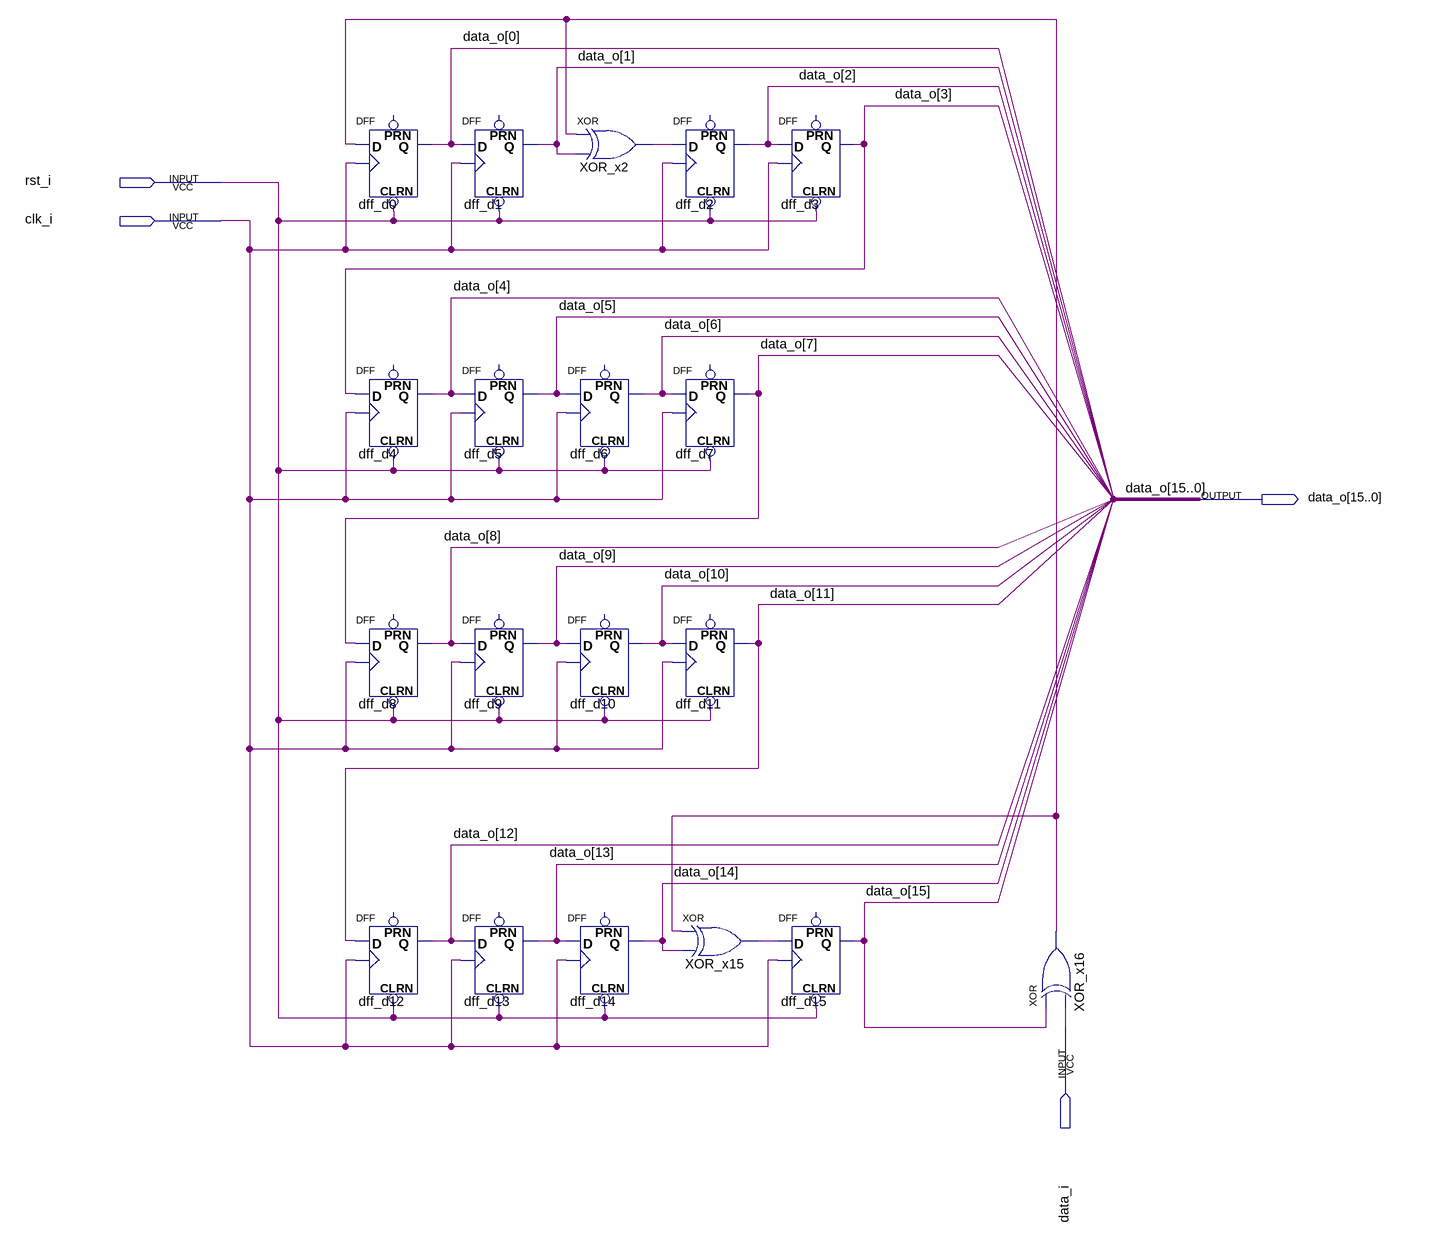
[diagram p0: schematic sheet]
// Quartus schematic crc_16_ansi.bdf as structural Verilog: 19 symbols, 4 pins
module crc_16_ansi (
  input  rst_i,
  input  clk_i,
  input  data_i,
  output [15:0] data_o
);

  wire XOR_x2_out, XOR_x15_out, XOR_x16_out;

  DFF dff_d0 (.CLRN(rst_i), .CLK(clk_i), .D(XOR_x16_out), .Q(data_o[0]));  // open: PRN
  DFF dff_d4 (.CLRN(rst_i), .CLK(clk_i), .D(data_o[3]), .Q(data_o[4]));  // open: PRN
  DFF dff_d8 (.CLRN(rst_i), .CLK(clk_i), .D(data_o[7]), .Q(data_o[8]));  // open: PRN
  DFF dff_d12 (.CLRN(rst_i), .CLK(clk_i), .D(data_o[11]), .Q(data_o[12]));  // open: PRN
  DFF dff_d1 (.CLRN(rst_i), .CLK(clk_i), .D(data_o[0]), .Q(data_o[1]));  // open: PRN
  DFF dff_d5 (.CLRN(rst_i), .CLK(clk_i), .D(data_o[4]), .Q(data_o[5]));  // open: PRN
  DFF dff_d9 (.CLRN(rst_i), .CLK(clk_i), .D(data_o[8]), .Q(data_o[9]));  // open: PRN
  DFF dff_d13 (.CLRN(rst_i), .CLK(clk_i), .D(data_o[12]), .Q(data_o[13]));  // open: PRN
  xor XOR_x2 (XOR_x2_out, XOR_x16_out, data_o[1]);
  DFF dff_d6 (.CLRN(rst_i), .CLK(clk_i), .D(data_o[5]), .Q(data_o[6]));  // open: PRN
  DFF dff_d10 (.CLRN(rst_i), .CLK(clk_i), .D(data_o[9]), .Q(data_o[10]));  // open: PRN
  DFF dff_d14 (.CLRN(rst_i), .CLK(clk_i), .D(data_o[13]), .Q(data_o[14]));  // open: PRN
  DFF dff_d2 (.CLRN(rst_i), .CLK(clk_i), .D(XOR_x2_out), .Q(data_o[2]));  // open: PRN
  DFF dff_d7 (.CLRN(rst_i), .CLK(clk_i), .D(data_o[6]), .Q(data_o[7]));  // open: PRN
  DFF dff_d11 (.CLRN(rst_i), .CLK(clk_i), .D(data_o[10]), .Q(data_o[11]));  // open: PRN
  xor XOR_x15 (XOR_x15_out, XOR_x16_out, data_o[14]);
  DFF dff_d3 (.CLRN(rst_i), .CLK(clk_i), .D(data_o[2]), .Q(data_o[3]));  // open: PRN
  DFF dff_d15 (.CLRN(rst_i), .CLK(clk_i), .D(XOR_x15_out), .Q(data_o[15]));  // open: PRN
  xor XOR_x16 (XOR_x16_out, data_o[15], data_i);
endmodule
